# Altium project 555cv.prjPCB.PrjPcb (part 3 of 4)

## Sheet MCU_Signals.SchDoc
size A4; DocumentNumber: 5; SheetNumber: 5; SheetTotal: 8
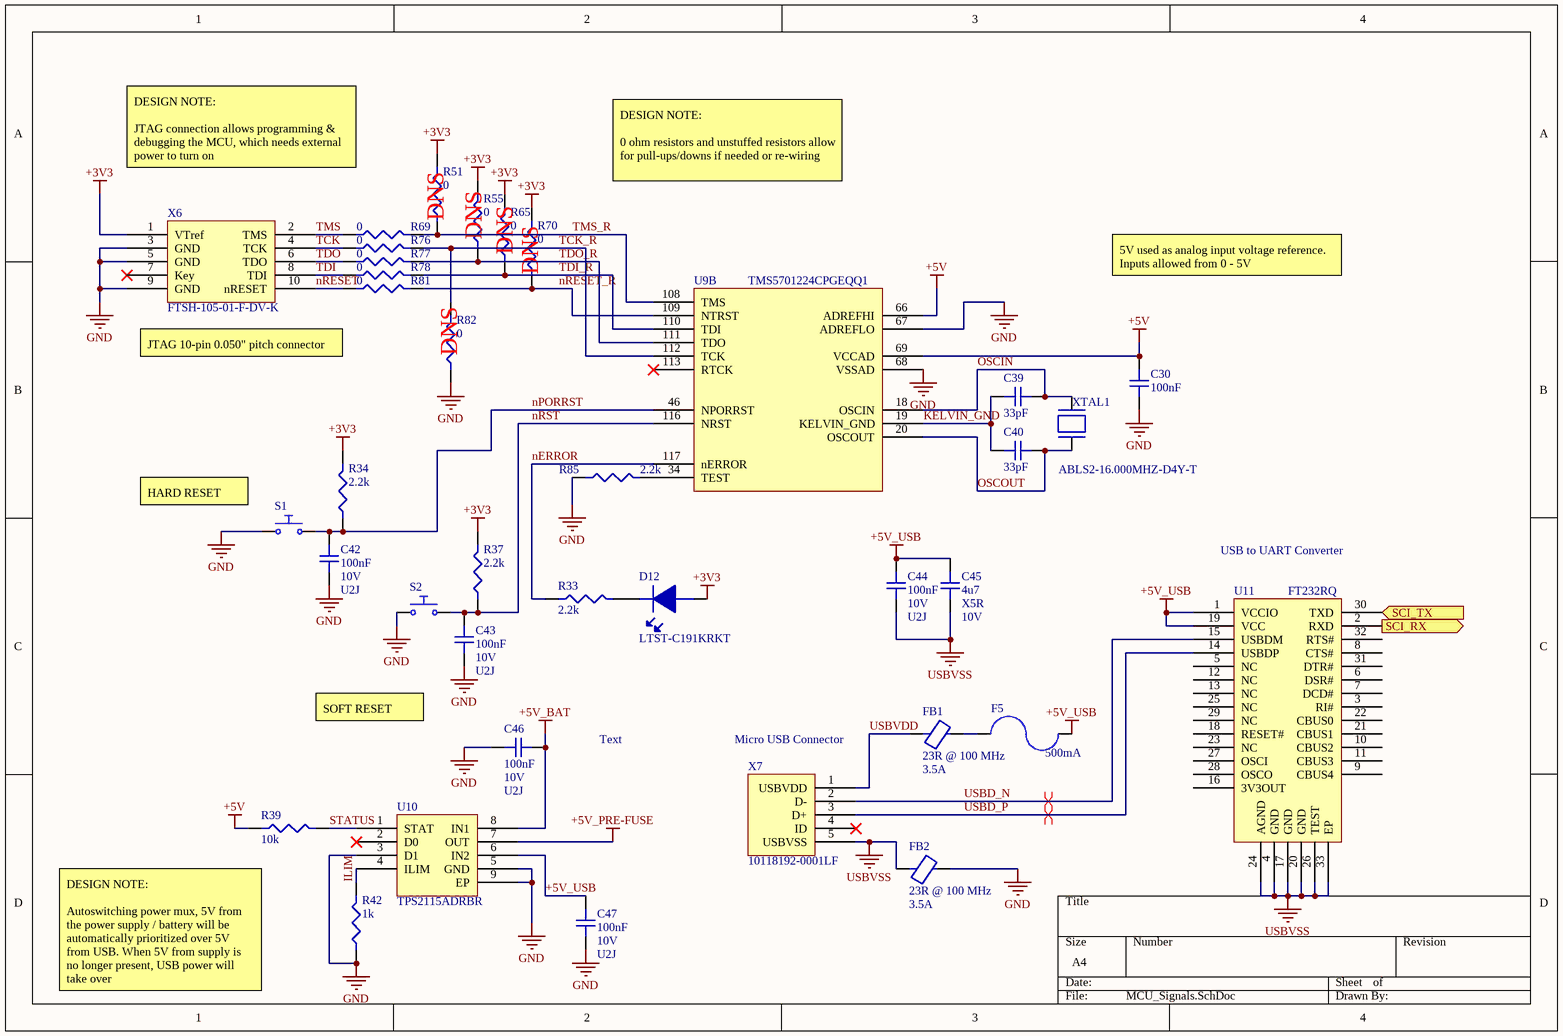
[diagram p4: MCU_Signals.SchDoc]

### Parts
C30  100nF  [C0805]
C39  33pF  [C0805]
C40  33pF  [C0805]
C42  100nF  Voltage Rating: 10V  Dielectric: U2J  [C0805]
C43  100nF  Voltage Rating: 10V  Dielectric: U2J  [C0805]
C44  100nF  Voltage Rating: 10V  Dielectric: U2J  [C0805]
C45  4u7  Dielectric: X5R  Voltage: 10V  [C0805]
C46  100nF  Voltage Rating: 10V  Dielectric: U2J  [C0805]
C47  100nF  Voltage Rating: 10V  Dielectric: U2J  [C0805]
D12  LTST-C191KRKT  [LED_0603]
F5  500mA  [FUSE_0603]
FB1  23R @ 100 MHz  Max Current Rating: 3.5A  [FB_1806]
FB2  23R @ 100 MHz  Max Current Rating: 3.5A  [FB_1806]
R33  2.2k  [R0805]
R34  2.2k  [R0805]
R37  2.2k  [R0805]
R39  10k  [R0805]
R42  1k  [R0805]
R51  0  [R0805]
R55  0  [R0805]
R65  0  [R0805]
R69  0  [R0805]
R70  0  [R0805]
R76  0  [R0805]
R77  0  [R0805]
R78  0  [R0805]
R81  0  [R0805]
R82  0  [R0805]
R85  2.2k  [R0805]
S1  PTS645SM43SMTR92LFS  [PUSH_BUTTON]  (value not drawn)
S2  PTS645SM43SMTR92LFS  [PUSH_BUTTON]  (value not drawn)
U9  TMS5701224CPGEQQ1  [LQFP-144]  (part B of 3)
U10  TPS2115ADRBR  [VSON-8]
U11  FT232RQ  [QFN-32]
X6  FTSH-105-01-F-DV-K  [JTAG_50mil_10pin]
X7  10118192-0001LF  [USB_MICRO]
XTAL1  ABLS2-16.000MHZ-D4Y-T  [XTAL]

### Ports
SCI_RX, SCI_TX

### Nets
+3V3: D12.1 R34.2 R37.2 R51.2 R55.2 R65.2 R70.2 X6.1(VTref)
+5V: C30.2 R39.1 U9.66(ADREFHI) U9.69(VCCAD)
+5V_BAT: C46.2 U10.8(IN1)
+5V_PRE-FUSE: U10.7(OUT)
+5V_USB: C44.2 C45.2 C47.1 F5.2 U10.6(IN2) U11.1(VCCIO) U11.19(VCC)
GND: C30.1 C42.1 C43.1 C46.1 C47.2 FB2.2 R42.1 R82.1 R85.1 S1.1 S2.1 U9.67(ADREFLO) U9.68(VSSAD) U10.3(D1) U10.5(GND) U10.9(EP) X6.3(GND) X6.5(GND) X6.9(GND)
USBVSS: C44.1 C45.1 FB2.1 U11.4(GND) U11.17(GND) U11.20(GND) U11.24(AGND) U11.26(TEST) U11.33(EP) X7.5(USBVSS)
ILIM: R42.2 U10.4(ILIM)
KELVIN_GND: C39.1 C40.1 U9.19(KELVIN_GND)
nERROR: R33.1 U9.117(nERROR)
nPORRST: C42.2 R34.1 S1.2 U9.46(NPORRST)
nRESET: R81.1 X6.10(nRESET)
nRESET_R: R70.1 R81.2 U9.109(NTRST)
nRST: C43.2 R37.1 S2.2 U9.116(NRST)
OSCIN: C39.2 U9.18(OSCIN) XTAL1.1
OSCOUT: C40.2 U9.20(OSCOUT) XTAL1.2
SCI_RX: U11.2(RXD) ; port SCI_RX
SCI_TX: U11.30(TXD) ; port SCI_TX
STATUS: R39.2 U10.1(STAT)
TCK: R76.1 X6.4(TCK)
TCK_R: R76.2 R82.2 U9.112(TCK)
TDI: R78.1 X6.8(TDI)
TDI_R: R65.1 R78.2 U9.110(TDI)
TDO: R77.1 X6.6(TDO)
TDO_R: R55.1 R77.2 U9.111(TDO)
TMS: R69.1 X6.2(TMS)
TMS_R: R51.1 R69.2 U9.108(TMS)
USBD_N: U11.15(USBDM) X7.2(D-)
USBD_P: U11.14(USBDP) X7.3(D+)
USBVDD: FB1.1 X7.1(USBVDD)
NetD12_2: D12.2 R33.2
NetF5_1: F5.1 FB1.2
NetR85_2: R85.2 U9.34(TEST)

Not connected (* = marked no-connect by the designer): U9 113(RTCK)*; U10 2(D0)*; U11 3(RI#) 5(NC) 6(DSR#) 7(DCD#) 8(CTS#) 9(CBUS4) 10(CBUS2) 11(CBUS3) 12(NC) 13(NC) 16(3V3OUT) 18(RESET#) 21(CBUS1) 22(CBUS0) 23(NC) 25(NC) 27(OSCI) 28(OSCO) 29(NC) 31(DTR#) 32(RTS#); X6 7(Key)*; X7 4(ID)*

### Layout directives
differential pair: USBD_N, USBD_P

### Notes on the sheet
- DESIGN NOTE:
  JTAG connection allows programming & debugging the MCU, which needs external power to turn on
- DESIGN NOTE:
  0 ohm resistors and unstuffed resistors allow for pull-ups/downs if needed or re-wiring
- (near R51) DNS
- (near R55) DNS
- (near R65) DNS
- (near R70) DNS
- 5V used as analog input voltage reference. Inputs allowed from 0 - 5V
- JTAG 10-pin 0.050" pitch connector
- (near R82) DNS
- (near S1) HARD RESET
- USB to UART Converter
- SOFT RESET
- Text
- (near X7) Micro USB Connector
- (near R39) DESIGN NOTE:
  Autoswitching power mux, 5V from the power supply / battery will be automatically prioritized over 5V from USB. When 5V from supply is no longer present, USB power will take over

### Library data of the parts
C30 = GRM21B7U1A104JA01L: CAP MLCC 100nF 10Volts U2J 5%; Manufacturer: Murata; Voltage Rating: 10V; Supplier 1: Digi-Key; Manufacturer Part Number: GRM21B7U1A104JA01L; Stock 1: 6000; Pricing 1: 1=0.46, 10=0.32, 100=0.192, 500=0.144, 1000=0.1216 (USD); Mount: Surface Mount; Case/Package: 0805; Case Code (Imperial): 0805; Case Code (Metric): 2012; Min Operating Temperature: -55°C; Max Operating Temperature: 125°C; Capacitance: 100nF; Voltage Rating (DC): 10V; Tolerance: 5%; Packaging: Tape and Reel; Package Quantity: 3000; Dielectric: U2J; Termination: SMD/SMT; Length: 2mm; Height: 1.25mm; Width: 0.049inch; Thickness: 0.053inch; Depth: 1.25mm; Radiation Hardening: No; ComponentLink1URL: https://datasheet.ciiva.com/5424/product-5424660.pdf; ComponentLink1Description: https://datasheet.ciiva.com/5424/product-5424660.pdf; ComponentLink2URL: https://datasheet.ciiva.com/17451/product-17451845.pdf; ComponentLink2Description: https://datasheet.ciiva.com/17451/product-17451845.pdf; ComponentLink3URL: https://datasheet.ciiva.com/11618/product-11618924.pdf; ComponentLink3Description: https://datasheet.ciiva.com/11618/product-11618924.pdf; Supplier Part Number 1: 490-11592-6-ND
C39 C40 = 885012007003: CAP MLCC 33pF 10V Ceramic Capacitor C0G, NP0 0805 (2012 Metric) 0.079" L x 0.049" W (2.00mm x 1.25mm); Manufacturer: Wurth Electronics; Tolerance: 5%; Supplier 1: Digi-Key; Manufacturer Part Number: 885012007003; Stock 1: 3090; Pricing 1: 1=0.1, 50=0.068, 100=0.062, 250=0.056, 500=0.05, 1000=0.045 (USD); Mount: Surface Mount; Case/Package: 0805; Case Code (Metric): 2012; Case Code (Imperial): 0805; Min Operating Temperature: -55°C; Max Operating Temperature: 125°C; Packaging: Tape and Reel; Capacitance: 33pF; Voltage Rating: 10V; Length: 0.079inch; Width: 0.049inch; Thickness: 0.028inch; Supplier Part Number 1: 732-7808-1-ND
C42-C44 C46 C47 = GRM21B7U1A104JA01L: CAP MLCC 100nF 10Volts U2J 5%; Manufacturer: Murata; Supplier 1: Digi-Key; Manufacturer Part Number: GRM21B7U1A104JA01L; Stock 1: 6000; Pricing 1: 1=0.46, 10=0.32, 100=0.192, 500=0.144, 1000=0.1216 (USD); Mount: Surface Mount; Case/Package: 0805; Case Code (Imperial): 0805; Case Code (Metric): 2012; Min Operating Temperature: -55°C; Max Operating Temperature: 125°C; Capacitance: 100nF; Voltage Rating (DC): 10V; Tolerance: 5%; Packaging: Tape and Reel; Package Quantity: 3000; Termination: SMD/SMT; Length: 2mm; Height: 1.25mm; Width: 0.049inch; Thickness: 0.053inch; Depth: 1.25mm; Radiation Hardening: No; ComponentLink1URL: https://datasheet.ciiva.com/5424/product-5424660.pdf; ComponentLink1Description: https://datasheet.ciiva.com/5424/product-5424660.pdf; ComponentLink2URL: https://datasheet.ciiva.com/17451/product-17451845.pdf; ComponentLink2Description: https://datasheet.ciiva.com/17451/product-17451845.pdf; ComponentLink3URL: https://datasheet.ciiva.com/11618/product-11618924.pdf; ComponentLink3Description: https://datasheet.ciiva.com/11618/product-11618924.pdf; Supplier Part Number 1: 490-11592-6-ND
C45 = GRM219R61A475KE34D: CAP MLCC 4.7µF ±10% 10V X5R Ceramic Capacitor -55°C ~ 85°C Surface Mount, MLCC 0805 (2012 Metric) 0.079" L x 0.049" W (2.00mm x 1.25mm); Manufacturer: Murata; Capacitance: 4.7uF; Supplier 1: Digi-Key; Manufacturer Part Number: GRM219R61A475KE34D; Stock 1: 251830; Pricing 1: 1=0.21, 10=0.152, 100=0.0716, 500=0.0502, 1000=0.0416 (USD); Mount: Surface Mount; Case/Package: 0805; Case Code (Metric): 2012; Case Code (Imperial): 0805; Min Operating Temperature: -55°C; Max Operating Temperature: 85°C; Packaging: Tape and Reel; Tolerance: 10%; Package Quantity: 4000; Voltage Rating: 10V; Voltage Rating (DC): 10V; Termination: SMD/SMT; Length: 2mm; Height: 0.85mm; Width: 0.049inch; Thickness: 0.037inch; Depth: 1.25mm; Lead Free: Lead Free; ComponentLink1URL: https://datasheet.ciiva.com/169/product-169527.pdf; ComponentLink1Description: https://datasheet.ciiva.com/169/product-169527.pdf; ComponentLink2URL: https://datasheet.ciiva.com/5414/product-5414984.pdf; ComponentLink2Description: https://datasheet.ciiva.com/5414/product-5414984.pdf; ComponentLink3URL: https://datasheet.ciiva.com/16467/product-16467258.pdf; ComponentLink3Description: https://datasheet.ciiva.com/16467/product-16467258.pdf; ComponentLink4URL: https://datasheet.ciiva.com/29542/product-29542667.pdf; ComponentLink4Description: https://datasheet.ciiva.com/29542/product-29542667.pdf; ComponentLink5URL: https://datasheet.ciiva.com/29542/product-29542668.pdf; ComponentLink5Description: https://datasheet.ciiva.com/29542/product-29542668.pdf; Supplier Part Number 1: 490-3339-6-ND
D12 = LTST-C191KRKT: LED RED CLEAR 0603 SMD; Manufacturer: Vishay Lite-On; Lens Colour: Colorless; Power Rating: 75mW; Luminous Intensity: 54mcd; Viewing Angle: 130°; Forward Voltage: 2V; Lens Style: Clear,Diffused,Colorless,Rectangular; Forward Current: 30mA; Dominant Wavelength: 631nm; Test Current: 20mA; Number of Elements: 1; Wavelength: 639nm; Reverse Voltage: 5V; Supplier 1: Digi-Key; Manufacturer Part Number: LTST-C191KRKT; Stock 1: 684119; Pricing 1: 1=0.29, 10=0.211, 25=0.1556, 100=0.1111, 250=0.0756, 500=0.0667, 1000=0.0522, 2500=0.0511 (USD); Mount: Surface Mount; Case/Package: 0603; Number of Pins: 2; Colour: Red; Case Code (Metric): 1608; Case Code (Imperial): 0603; Min Operating Temperature: -55°C; Max Operating Temperature: 85°C; Packaging: Tape and Reel; Package Quantity: 1; Illumination Colour: Red; Lens Transparency: Clear; Power Dissipation: 75mW; Number of LEDs: 1; Voltage: 2V; Length: 1.6mm; Height: 0.55mm; Width: 0.8mm; Depth: 0.8mm; Radiation Hardening: No; Lead Free: Lead Free; ComponentLink1URL: https://datasheet.ciiva.com/11773/0900766b80dc02b2-11773601.pdf; ComponentLink1Description: https://datasheet.ciiva.com/11773/0900766b80dc02b2-11773601.pdf; ComponentLink2URL: https://datasheet.ciiva.com/2109/s-110-ltst-c191krkt-2109970.pdf; ComponentLink2Description: https://datasheet.ciiva.com/2109/s-110-ltst-c191krkt-2109970.pdf; ComponentLink3URL: https://datasheet.ciiva.com/2109/s-110-ltst-c191krkt-2109971.pdf; ComponentLink3Description: https://datasheet.ciiva.com/2109/s-110-ltst-c191krkt-2109971.pdf; ComponentLink4URL: https://datasheet.ciiva.com/16212/ltst-c191krkt-16212419.pdf; ComponentLink4Description: https://datasheet.ciiva.com/16212/ltst-c191krkt-16212419.pdf; ComponentLink5URL: https://datasheet.ciiva.com/2109/s-110-ltst-c191krkt-2109972.pdf; ComponentLink5Description: https://datasheet.ciiva.com/2109/s-110-ltst-c191krkt-2109972.pdf; ComponentLink6URL: https://datasheet.ciiva.com/15117/getdatasheetpartid-141922-15117737.pdf; ComponentLink6Description: https://datasheet.ciiva.com/15117/getdatasheetpartid-141922-15117737.pdf; ComponentLink7URL: https://datasheet.ciiva.com/12400/lite-on-ltst-c191krkt-190135-12400910.pdf; ComponentLink7Description: https://datasheet.ciiva.com/12400/lite-on-ltst-c191krkt-190135-12400910.pdf; Supplier Part Number 1: 160-1447-1-ND
F5 = ERB-RE0R50V: FUSE_0.5A SMD 0603, 0.5A; Manufacturer: Panasonic ECG; Body Material: Alumina; Voltage Rating (DC): 32V; DC Cold Resistance: 330mR; Fuse Type: Board Mount (Cartridge Style Excluded); Approvals: UL; Supplier 1: Digi-Key; Manufacturer Part Number: ERB-RE0R50V; Stock 1: 15715; Pricing 1: 1=0.29, 5=0.284, 10=0.272, 50=0.2424, 100=0.2257, 250=0.2006, 500=0.1672, 1000=0.1588 (USD); Mount: Surface Mount; Case/Package: 0603; Number of Pins: 2; Case Code (Metric): 1608; Case Code (Imperial): 0603; Min Operating Temperature: -40°C; Max Operating Temperature: 125°C; Current Rating: 500mA; Packaging: Tape and Reel; Package Quantity: 5000; Max Voltage Rating (DC): 32V; Voltage Rating: 32V; Current: 500mA; Fuse Current: 500mA; Length: 1.6mm; Height: 0.54mm; Width: 0.8mm; Depth: 0.8mm; Radiation Hardening: No; REACH SVHC: No SVHC; ComponentLink1URL: https://datasheet.ciiva.com/299/afa0000ce6-299092.pdf; ComponentLink1Description: https://datasheet.ciiva.com/299/afa0000ce6-299092.pdf; ComponentLink2URL: https://datasheet.ciiva.com/299/afa0000ce6-299093.pdf; ComponentLink2Description: https://datasheet.ciiva.com/299/afa0000ce6-299093.pdf; ComponentLink3URL: https://datasheet.ciiva.com/299/afa0000ce6-299094.pdf; ComponentLink3Description: https://datasheet.ciiva.com/299/afa0000ce6-299094.pdf; ComponentLink4URL: https://datasheet.ciiva.com/25619/0900766b810c2f76-25619783.pdf; ComponentLink4Description: https://datasheet.ciiva.com/25619/0900766b810c2f76-25619783.pdf; ComponentLink5URL: https://datasheet.ciiva.com/11337/afa0000ce6-11337817.pdf; ComponentLink5Description: https://datasheet.ciiva.com/11337/afa0000ce6-11337817.pdf; ComponentLink6URL: https://datasheet.ciiva.com/5813/1328695-5813626.pdf; ComponentLink6Description: https://datasheet.ciiva.com/5813/1328695-5813626.pdf; ComponentLink7URL: https://datasheet.ciiva.com/46388/1328695-46388892.pdf; ComponentLink7Description: https://datasheet.ciiva.com/46388/1328695-46388892.pdf; ComponentLink8URL: https://datasheet.ciiva.com/30017/afa0000ce6-30017405.pdf; ComponentLink8Description: https://datasheet.ciiva.com/30017/afa0000ce6-30017405.pdf; ComponentLink9URL: https://datasheet.ciiva.com/46376/1328695-46376557.pdf; ComponentLink9Description: https://datasheet.ciiva.com/46376/1328695-46376557.pdf; Supplier Part Number 1: P15127CT-ND
FB1 FB2 = FBMJ4516HL230NTV: FERRITE BEAD Ind Chip Bead Multi-Layer 23Ohm 30% 100MHz Ferrite 3.5A 1806 T/R; Manufacturer: Taiyo Yuden; Resistance: 180623R; Number of Lines: 1; DC Resistance (DCR): 14mR; Supplier 1: Digi-Key; Manufacturer Part Number: FBMJ4516HL230NTV; Stock 1: 1819; Pricing 1: 1=0.26, 10=0.202, 25=0.1676, 50=0.1444, 100=0.1299, 250=0.1097, 500=0.0982, 1000=0.0837 (USD); Mount: Surface Mount; Case/Package: 1806; Core Material: Ferrite; Case Code (Metric): 4516; Case Code (Imperial): 1806; Min Operating Temperature: -40°C; Max Operating Temperature: 125°C; Tolerance: 30%; Impedance: 23R; Package Quantity: 2000; Packaging: Tape and Reel; Max DC Current: 3.5A; Termination: SMD/SMT; Test Frequency: 100MHz; Length: 0.177inch; Height: 1.1mm; Width: 1.6mm; Depth: 1.6mm; ComponentLink1URL: http://www.mouser.com/ds/2/396/chipbeads01_e-559265.pdf; ComponentLink1Description: http://www.mouser.com/ds/2/396/chipbeads01_e-559265.pdf; ComponentLink2URL: http://ds.yuden.co.jp/TYCOMPAS/ut/detail.do?productNo=FBMJ4516HL230NTV&fileName=FBMJ4516HL230NTV_SS&mode=specSheetDownload; ComponentLink2Description: http://ds.yuden.co.jp/TYCOMPAS/ut/detail.do?productNo=FBMJ4516HL230NTV&fileName=FBMJ4516HL230NTV_SS&mode=specSheetDownload; ComponentLink3URL: https://www.yuden.co.jp/ut/product/category/emisuppression/FBMJ4516HL230NTV_SS.pdf; ComponentLink3Description: https://www.yuden.co.jp/ut/product/category/emisuppression/FBMJ4516HL230NTV_SS.pdf; Supplier Part Number 1: 587-3857-1-ND
R33 R34 R37 R85 = RC0805JR-072K2L: RES SMD 2.2K OHM 5% 1/8W; Manufacturer: Yageo; Resistance: 2.2kR; Temperature Coefficient: 100ppm/°C; Power Rating: 125mW; Voltage Rating: 150V; Supplier 1: Digi-Key; Manufacturer Part Number: RC0805JR-072K2L; Stock 1: 810523; Pricing 1: 1=0.1, 10=0.019, 100=0.0076, 1000=0.0034, 2500=0.003 (USD); Case/Package: 0805; Contact Plating: Tin,Lead,Matte; Case Code (Imperial): 0805; Case Code (Metric): 2012; Min Operating Temperature: -55°C; Max Operating Temperature: 155°C; Tolerance: 5%; Packaging: Tape and Reel; Composition: Thick Film; Termination: SMD/SMT; Military Standard: Not; Length: 2mm; Depth: 1.25mm; Radiation Hardening: No; REACH SVHC: Unknown; Lead Free: Lead Free; ComponentLink1URL: https://datasheet.ciiva.com/12667/rc0805-12667397.pdf; ComponentLink1Description: https://datasheet.ciiva.com/12667/rc0805-12667397.pdf; ComponentLink2URL: https://datasheet.ciiva.com/15190/getdatasheetpartid-251869-15190044.pdf; ComponentLink2Description: https://datasheet.ciiva.com/15190/getdatasheetpartid-251869-15190044.pdf; ComponentLink3URL: https://datasheet.ciiva.com/7941/442941-7941935.pdf; ComponentLink3Description: https://datasheet.ciiva.com/7941/442941-7941935.pdf; Supplier Part Number 1: 311-2.2KARCT-ND
R39 = RC0805FR-071KL: RES SMD 10K OHM 1% 1/8W 0805; Manufacturer: Yageo Phycomp; Temperature Coefficient: 100ppm/°C; Resistance: 1KR; Voltage Rating (DC): 150V; Power Rating: 125mW; Supplier 1: Digi-Key; Manufacturer Part Number: RC0805FR-071KL; Stock 1: 5527973; Pricing 1: 1=0.1, 10=0.022, 100=0.0088, 1000=0.004, 2500=0.0034 (USD); Case/Package: 0805; Number of Pins: 2; Min Operating Temperature: -55°C; Max Operating Temperature: 155°C; Tolerance: 1%; Packaging: Cut Tape; Length: 2mm; Height: 0.5mm; Width: 1.25mm; Depth: 1.25mm; REACH SVHC: No SVHC; Lead Free: Lead Free
R42 = ERA-6AEB102V: RES SMD 1K OHM 0805 1K Ohm 0.1% 0.125W(1/8W) ±25ppm/C Molded SMD Automotive Punched T/R; Manufacturer: Panasonic ECG; Voltage Rating: 100V; Resistance: 1kR; Power Rating: 125mW; Temperature Coefficient: 25ppm/°C; Supplier 1: Digi-Key; Manufacturer Part Number: ERA-6AEB102V; Stock 1: 506583; Pricing 1: 1=0.36, 10=0.302, 100=0.1182, 1000=0.0495, 2500=0.0454 (USD); Mount: Surface Mount; Case/Package: 0805; Number of Pins: 2; Case Code (Metric): 2012; Case Code (Imperial): 0805; Contact Plating: Tin; Min Operating Temperature: -55°C; Max Operating Temperature: 155°C; Packaging: Tape and Reel; Tolerance: 0.1%; Package Quantity: 5000; Composition: Thin Film; Number of Terminations: 2; Military Standard: Not; Termination: SMD/SMT; Max Power Dissipation: 125mW; Length: 2mm; Height: 0.5mm; Width: 1.25mm; Depth: 1.25mm; Radiation Hardening: No; REACH SVHC: No SVHC; ComponentLink1URL: https://datasheet.ciiva.com/11811/0900766b80beefcc-11811155.pdf; ComponentLink1Description: https://datasheet.ciiva.com/11811/0900766b80beefcc-11811155.pdf; ComponentLink2URL: https://datasheet.ciiva.com/30057/54aoa0000ce26-30057591.pdf; ComponentLink2Description: https://datasheet.ciiva.com/30057/54aoa0000ce26-30057591.pdf; ComponentLink3URL: https://datasheet.ciiva.com/48536/era-eng-tds-48536727.pdf; ComponentLink3Description: https://datasheet.ciiva.com/48536/era-eng-tds-48536727.pdf; ComponentLink4URL: https://datasheet.ciiva.com/9198/aoa0000ce26-9198984.pdf; ComponentLink4Description: https://datasheet.ciiva.com/9198/aoa0000ce26-9198984.pdf; ComponentLink5URL: https://datasheet.ciiva.com/16782/70068849-16782808.pdf; ComponentLink5Description: https://datasheet.ciiva.com/16782/70068849-16782808.pdf; ComponentLink6URL: https://datasheet.ciiva.com/24025/aoa0000ce26-197354-24025849.pdf; ComponentLink6Description: https://datasheet.ciiva.com/24025/aoa0000ce26-197354-24025849.pdf; ComponentLink7URL: https://datasheet.ciiva.com/43455/485442-43455257.pdf; ComponentLink7Description: https://datasheet.ciiva.com/43455/485442-43455257.pdf; ComponentLink8URL: https://datasheet.ciiva.com/43457/485442-43457803.pdf; ComponentLink8Description: https://datasheet.ciiva.com/43457/485442-43457803.pdf; ComponentLink9URL: https://datasheet.ciiva.com/7942/485442-7942414.pdf; ComponentLink9Description: https://datasheet.ciiva.com/7942/485442-7942414.pdf; ComponentLink10URL: https://datasheet.ciiva.com/16201/aoa0000ce26-16201486.pdf; ComponentLink10Description: https://datasheet.ciiva.com/16201/aoa0000ce26-16201486.pdf; ComponentLink11URL: https://datasheet.ciiva.com/22783/485442-22783806.pdf; ComponentLink11Description: https://datasheet.ciiva.com/22783/485442-22783806.pdf; ComponentLink12URL: https://datasheet.ciiva.com/7942/485442-7942415.pdf; ComponentLink12Description: https://datasheet.ciiva.com/7942/485442-7942415.pdf; ComponentLink13URL: https://datasheet.ciiva.com/29184/453027-da-01-en-widerstand-0805-era-29184108.pdf; ComponentLink13Description: https://datasheet.ciiva.com/29184/453027-da-01-en-widerstand-0805-era-29184108.pdf; Supplier Part Number 1: P1.0KDACT-ND
R51 R55 R65 R69 R70 R76-R78 R81 R82 = RC0805JR-070RL: RES SMD 0 OHM 1/8W 0805; Manufacturer: Yageo; Resistance: 0mR; Tolerance: 5%; Voltage Rating: 150V; Power Rating: 125mW; Temperature Coefficient: 200ppm/°C; Supplier 1: Digi-Key; Manufacturer Part Number: RC0805JR-070RL; Stock 1: 5922085; Pricing 1: 1=0.1, 10=0.018, 25=0.0128, 50=0.0096, 100=0.0071, 250=0.0054, 500=0.0044, 1000=0.0032 (USD); Case/Package: 0805; Number of Pins: 2; Case Code (Imperial): 0805; Case Code (Metric): 2012; Contact Plating: Tin,Matte; Min Operating Temperature: -55°C; Max Operating Temperature: 155°C; Packaging: Tape and Reel; Voltage Rating (DC): 150V; Termination: SMD/SMT; Composition: Thick Film; Military Standard: Not; Length: 2mm; Height: 0.5mm; Width: 1.25mm; Depth: 1.25mm; Radiation Hardening: No; REACH SVHC: Unknown; Lead Free: Lead Free; ComponentLink1URL: https://datasheet.ciiva.com/7941/1738694-7941861.pdf; ComponentLink1Description: https://datasheet.ciiva.com/7941/1738694-7941861.pdf; ComponentLink2URL: https://datasheet.ciiva.com/7941/1738694-7941862.pdf; ComponentLink2Description: https://datasheet.ciiva.com/7941/1738694-7941862.pdf; ComponentLink3URL: https://datasheet.ciiva.com/11819/0900766b8106beab-11819430.pdf; ComponentLink3Description: https://datasheet.ciiva.com/11819/0900766b8106beab-11819430.pdf; ComponentLink4URL: https://datasheet.ciiva.com/7941/1738694-7941863.pdf; ComponentLink4Description: https://datasheet.ciiva.com/7941/1738694-7941863.pdf; ComponentLink5URL: https://datasheet.ciiva.com/15190/getdatasheetpartid-330685-15190028.pdf; ComponentLink5Description: https://datasheet.ciiva.com/15190/getdatasheetpartid-330685-15190028.pdf; Supplier Part Number 1: 311-0.0ARDKR-ND
S1 S2 = PTS645SM43SMTR92LFS: SWITCH TACTILE SPST-NO 0.05A 12V; Manufacturer: ITT C&K; Mechanical Life: 100000Cycles; Actuator Material: Nylon,Polyamide; Throw Configuration: SPST; Contact Resistance: 100mR; Operating Force: 160gf; Max Current Rating: 50mA; Illumination Type: Non-Illuminated,Illuminated; Switch Function: Off-Mom; Actuator Length: 0.85mm; Supplier 1: Digi-Key; Manufacturer Part Number: PTS645SM43SMTR92LFS; Stock 1: 188827; Pricing 1: 1=0.16, 10=0.157, 25=0.1516, 50=0.1462, 100=0.1381, 250=0.13, 500=0.1245 (USD); Mount: Surface Mount; Case/Package: SMD/SMT; Contact Plating: Silver; Contact Material: Silver; Colour: Black; Min Operating Temperature: -20°C; Max Operating Temperature: 60°C; Max Voltage Rating (DC): 12V; Packaging: Tape and Reel; Package Quantity: 1000; Current Rating: 50mA; Voltage Rating (DC): 12V; Termination: Gull Wing; Orientation: Straight; Length: 6mm; Depth: 9mm; REACH SVHC: No SVHC; Lead Free: Lead Free; ComponentLink1URL: https://datasheet.ciiva.com/29903/getdatasheetpartid-786341-29903846.pdf; ComponentLink1Description: https://datasheet.ciiva.com/29903/getdatasheetpartid-786341-29903846.pdf; ComponentLink2URL: https://datasheet.ciiva.com/14920/pts645-14920733.pdf; ComponentLink2Description: https://datasheet.ciiva.com/14920/pts645-14920733.pdf; ComponentLink3URL: https://datasheet.ciiva.com/14920/pts645-14920734.pdf; ComponentLink3Description: https://datasheet.ciiva.com/14920/pts645-14920734.pdf; ComponentLink4URL: https://datasheet.ciiva.com/14920/pts645-14920735.pdf; ComponentLink4Description: https://datasheet.ciiva.com/14920/pts645-14920735.pdf; ComponentLink5URL: https://datasheet.ciiva.com/29931/getdatasheetpartid-764615-29931183.pdf; ComponentLink5Description: https://datasheet.ciiva.com/29931/getdatasheetpartid-764615-29931183.pdf; Supplier Part Number 1: CKN9112CT-ND
U9 = TMS5701224CPGEQQ1: ARM CORTEX R4 LOCK STEP HERCULES MCU; Manufacturer: Texas Instruments; Frequency: 160MHz; Interface: I2C,SPI,CAN,UART,USART,LIN,SCI,EBI/EMI; Number of I/Os: 64; Oscillator Type: External; RAM Size: 192KB; Number of Timers/Counters: 2; Watchdog Timer: Yes; Memory Type: FLASH; Memory Size: 1.25MB; Density: 1310720B; Peripherals: POR,PWM,WDT,DMA; Supplier 1: Digi-Key; Manufacturer Part Number: TMS5701224CPGEQQ1; Stock 1: 113; Pricing 1: 1=22.12, 10=20.402, 100=17.4222, 500=15.8176 (USD); Case/Package: LQFP; Number of Pins: 144; Min Operating Temperature: -40°C; Max Operating Temperature: 125°C; Packaging: Tray; Number of Programmable I/O: 64; Max Frequency: 160MHz; Number of GPIO: 64; Core Architecture: ARM; Lead Free: Lead Free; ComponentLink1URL: http://www.ti.com/lit/pdf/spnu515; ComponentLink1Description: http://www.ti.com/lit/pdf/spnu515; ComponentLink2URL: http://www.ti.com/lit/gpn/tms570ls1224; ComponentLink2Description: http://www.ti.com/lit/gpn/tms570ls1224; ComponentLink3URL: http://www.ti.com/general/docs/lit/getliterature.tsp?genericPartNumber=TMS570LS1224&&fileType=pdf; ComponentLink3Description: http://www.ti.com/general/docs/lit/getliterature.tsp?genericPartNumber=TMS570LS1224&&fileType=pdf; Supplier Part Number 1: 296-47200-ND
U10 = TPS2115ADRBR: IC OR CTRLR SRC SELECT 8SON; Manufacturer: Texas Instruments; Operating Supply Voltage: 5.5V; Number of Inputs: 2; Number of Outputs: 1; Output Current: 1.25A; Max Power Dissipation: 2.5W; Min Input Voltage: 2.8V; On-State Resistance: 150mR; Turn-On Delay Time: 1ms; Turn-Off Delay Time: 5ms; Max Supply Current: 55uA; Supplier 1: Digi-Key; Manufacturer Part Number: TPS2115ADRBR; Stock 1: 13497; Pricing 1: 1=2.01, 10=1.801, 100=1.448, 500=1.1897, 1000=0.9857 (USD); Case/Package: TSSOP; Number of Pins: 8; Weight: 0.000847oz; Min Operating Temperature: -40°C; Max Operating Temperature: 85°C; Package Quantity: 3000; Packaging: Tape and Reel; Max Output Current: 1.25A; Max Input Voltage: 5.5V; Operating Supply Current: 55uA; Current - Output 2: 1.25A; Radiation Hardening: No; Lead Free: Lead Free; REACH SVHC: No SVHC; ComponentLink1URL: https://datasheet.ciiva.com/15109/getdatasheetpartid-221489-15109265.pdf; ComponentLink1Description: https://datasheet.ciiva.com/15109/getdatasheetpartid-221489-15109265.pdf; ComponentLink2URL: https://datasheet.ciiva.com/1960/tps2115a-1960792.pdf; ComponentLink2Description: https://datasheet.ciiva.com/1960/tps2115a-1960792.pdf; ComponentLink3URL: https://datasheet.ciiva.com/3232/tps2115a-3232536.pdf; ComponentLink3Description: https://datasheet.ciiva.com/3232/tps2115a-3232536.pdf; ComponentLink4URL: https://datasheet.ciiva.com/1960/tps2115a-1960793.pdf; ComponentLink4Description: https://datasheet.ciiva.com/1960/tps2115a-1960793.pdf; ComponentLink5URL: https://datasheet.ciiva.com/1960/tps2115a-1960794.pdf; ComponentLink5Description: https://datasheet.ciiva.com/1960/tps2115a-1960794.pdf; Supplier Part Number 1: 296-23394-1-ND
U11 = FT232RQ-REEL: IC USB FS SERIAL UART 32-QFN; Manufacturer: FTDI; Max Supply Voltage: 5.25V; Min Supply Voltage: 3.3V; Operating Supply Voltage: 5V; Number of Channels: 1; Data Rate: 12Mbps; Operating Supply Current: 15mA; Supplier 1: Digi-Key; Manufacturer Part Number: FT232RQ-REEL; Stock 1: 97831; Pricing 1: 1=4.5, 10=4.05, 100=3.65, 250=3.25, 500=2.85, 1000=2.65, 2500=2.35 (USD); Mount: Surface Mount; Case/Package: QFN EP; Number of Pins: 32; Weight: 0.006653oz; Min Operating Temperature: -40°C; Max Operating Temperature: 85°C; Packaging: Tape and Reel; Package Quantity: 6000; Interface: UART; Length: 5mm; Width: 5mm; Radiation Hardening: No; Lead Free: Lead Free; ComponentLink1URL: https://datasheet.ciiva.com/1505/1647396-1505445.pdf; ComponentLink1Description: https://datasheet.ciiva.com/1505/1647396-1505445.pdf; ComponentLink2URL: https://datasheet.ciiva.com/1787/ds-ft232r-1787041.pdf; ComponentLink2Description: https://datasheet.ciiva.com/1787/ds-ft232r-1787041.pdf; ComponentLink3URL: https://datasheet.ciiva.com/1787/ds-ft232r-1787042.pdf; ComponentLink3Description: https://datasheet.ciiva.com/1787/ds-ft232r-1787042.pdf; ComponentLink4URL: https://datasheet.ciiva.com/16438/ds-ft232r-16438555.pdf; ComponentLink4Description: https://datasheet.ciiva.com/16438/ds-ft232r-16438555.pdf; ComponentLink5URL: https://datasheet.ciiva.com/15150/getdatasheetpartid-644721-15150509.pdf; ComponentLink5Description: https://datasheet.ciiva.com/15150/getdatasheetpartid-644721-15150509.pdf; ComponentLink6URL: https://datasheet.ciiva.com/4787/ds-ft232r-4787663.pdf; ComponentLink6Description: https://datasheet.ciiva.com/4787/ds-ft232r-4787663.pdf; ComponentLink7URL: https://datasheet.ciiva.com/26841/ft232rq-reel-26841082.pdf; ComponentLink7Description: https://datasheet.ciiva.com/26841/ft232rq-reel-26841082.pdf; Supplier Part Number 1: 768-1008-1-ND
X6 = FTSH-105-01-F-DV-K: CONN_JTAG_10pin .050 Connector Dual Header 10 Position Surface Mount; Manufacturer: Samtec; Max Current Rating: 1.75A; Number of Positions: 10; Connector Type: Male Pin; Pitch: 1.27mm; Row Spacing: 0.05inch; Supplier 1: Digi-Key; Manufacturer Part Number: FTSH-105-01-F-DV-K; Stock 1: 18199; Pricing 1: 1=2.9, 10=2.784, 100=2.32, 500=1.972, 1000=1.682, 5000=1.508 (USD); Mount: Surface Mount; Contact Material: Bronze,Copper; Contact Plating: Nickel,Gold; Colour: Black; Housing Colour: Black; Housing Material: Polymer; Min Operating Temperature: -55°C; Max Operating Temperature: 125°C; Number of Rows: 2; Packaging: Rail/Tube; Package Quantity: 1; Termination: Solder; Number of Contacts: 10; Orientation: Straight; Length: 15.2mm; Height: 3.3mm; Contact Mating Length: 0.12inch; Depth: 3.43mm; Radiation Hardening: No; Lead Free: Lead Free; ComponentLink1URL: https://datasheet.ciiva.com/19461/2046846-19461026.pdf; ComponentLink1Description: https://datasheet.ciiva.com/19461/2046846-19461026.pdf; ComponentLink2URL: https://datasheet.ciiva.com/738/ftsh-1xx-xx-xxx-dv-xxx-mkt-738998.pdf; ComponentLink2Description: https://datasheet.ciiva.com/738/ftsh-1xx-xx-xxx-dv-xxx-mkt-738998.pdf; ComponentLink3URL: https://datasheet.ciiva.com/10245/ftsh-mt-10245273.pdf; ComponentLink3Description: https://datasheet.ciiva.com/10245/ftsh-mt-10245273.pdf; ComponentLink4URL: https://datasheet.ciiva.com/16657/ftsh-mt-16657371.pdf; ComponentLink4Description: https://datasheet.ciiva.com/16657/ftsh-mt-16657371.pdf; ComponentLink5URL: https://datasheet.ciiva.com/15195/getdatasheetpartid-133463-15195260.pdf; ComponentLink5Description: https://datasheet.ciiva.com/15195/getdatasheetpartid-133463-15195260.pdf; Supplier Part Number 1: SAM8796-ND
X7 = 10118192-0001LF: CONN_USB - micro B USB 2.0 Receptacle Connector 5 Position Surface Mount, Right Angle, Horizontal; Manufacturer: Amphenol FCI; Current Rating: 1.8A; Connector Type: USB,Receptacle; Number of Contacts: 5; Insulation Resistance: 1GR; Number of Ports: 1; Max Voltage Rating (AC): 100V; USB Standard: USB 2.0; Pitch: 0.65mm; Supplier 1: Digi-Key; Manufacturer Part Number: 10118192-0001LF; Stock 1: 197826; Pricing 1: 1=0.46, 10=0.437, 25=0.3744, 50=0.318, 100=0.3056, 250=0.2744, 500=0.262 (USD); Mount: Surface Mount,Horizontal; Contact Material: Copper Alloy; Contact Plating: Nickel,Gold; Number of Terminals: 5; Housing Material: Polymer; Colour: Black; Min Operating Temperature: -55°C; Max Operating Temperature: 85°C; Packaging: Tape and Reel; Package Quantity: 1400; Gender: Receptacle; Termination: Solder; Voltage Rating: 100V; Orientation: Right Angle; Length: 7.86mm; Depth: 5.57mm; Radiation Hardening: No; REACH SVHC: No SVHC; Lead Free: Lead Free; Flammability Rating: UL94 V-0; ComponentLink1URL: https://datasheet.ciiva.com/26853/getdatasheetpartid-418041-26853891.pdf; ComponentLink1Description: https://datasheet.ciiva.com/26853/getdatasheetpartid-418041-26853891.pdf; ComponentLink2URL: https://datasheet.ciiva.com/851/10118192-851112.pdf; ComponentLink2Description: https://datasheet.ciiva.com/851/10118192-851112.pdf; ComponentLink3URL: https://datasheet.ciiva.com/4598/10118192ac-197249-4598796.pdf; ComponentLink3Description: https://datasheet.ciiva.com/4598/10118192ac-197249-4598796.pdf; Supplier Part Number 1: 609-4613-1-ND
XTAL1 = ABLS2-16.000MHZ-D4Y-T: XTAL 16MHz ±30ppm Crystal 18pF 40 Ohm -40°C ~ 85°C  Surface Mount HC49/US; Manufacturer: Abracon; ESR (Equivalent Series Resistance): 40R; Supplier 1: Digi-Key; Manufacturer Part Number: ABLS2-16.000MHZ-D4Y-T; Stock 1: 14083; Pricing 1: 1=0.46, 10=0.385, 50=0.3466, 100=0.308, 500=0.2926 (USD); Mount: Surface Mount; Min Operating Temperature: -40°C; Max Operating Temperature: 85°C; Package Quantity: 1000; Frequency: 16MHz; Frequency Tolerance: 30ppm; Load Capacitance: 18pF; Packaging: Tape and Reel; Tolerance: 30ppm; Frequency Stability: 30ppm; Termination: SMD/SMT; Series Resistance: 40R; Length: 11.05mm; Height: 0.13inch; Width: 0.185inch; Depth: 4.8mm; REACH SVHC: Unknown; Lead Free: Lead Free; ComponentLink1URL: https://datasheet.ciiva.com/854/abls2-854400.pdf; ComponentLink1Description: https://datasheet.ciiva.com/854/abls2-854400.pdf; ComponentLink2URL: https://datasheet.ciiva.com/854/abls2-854401.pdf; ComponentLink2Description: https://datasheet.ciiva.com/854/abls2-854401.pdf; ComponentLink3URL: https://datasheet.ciiva.com/15116/getdatasheetpartid-719900-15116780.pdf; ComponentLink3Description: https://datasheet.ciiva.com/15116/getdatasheetpartid-719900-15116780.pdf; ComponentLink4URL: https://datasheet.ciiva.com/854/abls2-854399.pdf; ComponentLink4Description: https://datasheet.ciiva.com/854/abls2-854399.pdf; Supplier Part Number 1: 535-9875-1-ND

## Sheet CAN.SchDoc
size A4; DocumentNumber: 6; SheetNumber: 6; SheetTotal: 8
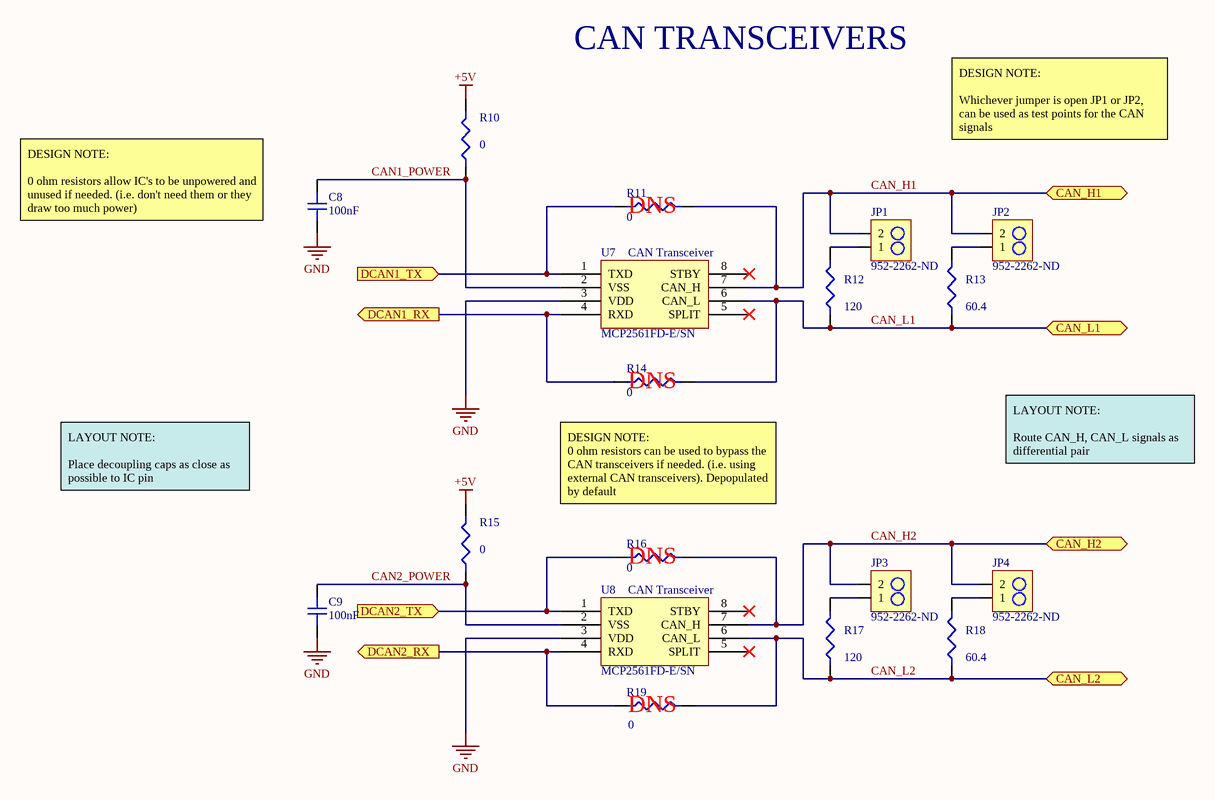
[diagram p5: CAN.SchDoc]

### Parts
C8  100nF  [C0805]
C9  100nF  [C0805]
JP1  952-2262-ND  [2PIN_HEADER]
JP2  952-2262-ND  [2PIN_HEADER]
JP3  952-2262-ND  [2PIN_HEADER]
JP4  952-2262-ND  [2PIN_HEADER]
R10  0  [R0805]
R11  0  [R0805]
R12  120  [R0805]
R13  60.4  [R0805]
R14  0  [R0805]
R15  0  [R0805]
R16  0  [R0805]
R17  120  [R0805]
R18  60.4  [R0805]
R19  0  [R0805]
U7  MCP2561FD-E/SN  [8-SOIC_MCP2561]
U8  MCP2561FD-E/SN  [8-SOIC_MCP2561]

### Ports
CAN_H1, CAN_H2, CAN_L1, CAN_L2, DCAN1_RX, DCAN1_TX, DCAN2_RX, DCAN2_TX

### Nets
+5V: R10.2 R15.2
GND: C8.1 C9.1 U7.3(VDD) U8.3(VDD)
CAN1_POWER: C8.2 R10.1 U7.2(VSS)
CAN2_POWER: C9.2 R15.1 U8.2(VSS)
CAN_H1: JP1.2 JP2.2 R11.2 U7.7(CAN_H) ; port CAN_H1
CAN_H2: JP3.2 JP4.2 R16.2 U8.7(CAN_H) ; port CAN_H2
CAN_L1: R12.1 R13.1 R14.2 U7.6(CAN_L) ; port CAN_L1
CAN_L2: R17.1 R18.1 R19.2 U8.6(CAN_L) ; port CAN_L2
DCAN1_RX: R14.1 U7.4(RXD) ; port DCAN1_RX
DCAN1_TX: R11.1 U7.1(TXD) ; port DCAN1_TX
DCAN2_RX: R19.1 U8.4(RXD) ; port DCAN2_RX
DCAN2_TX: R16.1 U8.1(TXD) ; port DCAN2_TX
NetJP1_1: JP1.1 R12.2
NetJP2_1: JP2.1 R13.2
NetJP3_1: JP3.1 R17.2
NetJP4_1: JP4.1 R18.2

Not connected (* = marked no-connect by the designer): U7 5(SPLIT)* 8(STBY)*; U8 5(SPLIT)* 8(STBY)*

### Notes on the sheet
- CAN TRANSCEIVERS
- DESIGN NOTE:
  Whichever jumper is open JP1 or JP2, can be used as test points for the CAN signals
- DESIGN NOTE:
  0 ohm resistors allow IC's to be unpowered and unused if needed. (i.e. don't need them or they draw too much power)
- (near R11) DNS
- (near U7) CAN Transceiver
- (near R14) DNS
- LAYOUT NOTE:
  Place decoupling caps as close as possible to IC pin
- LAYOUT NOTE:
  Route CAN_H, CAN_L signals as differential pair
- DESIGN NOTE:
  0 ohm resistors can be used to bypass the CAN transceivers if needed. (i.e. using external CAN transceivers). Depopulated by default
- (near U8) CAN Transceiver
- (near R16) DNS
- (near R19) DNS

### Library data of the parts
C8 C9 = GRM21B7U1A104JA01L: as C30 on sheet MCU_Signals; Supplier 1: Digi-Key; Manufacturer Part Number: GRM21B7U1A104JA01L; Stock 1: 6000; Pricing 1: 1=0.46, 10=0.32, 100=0.192, 500=0.144, 1000=0.1216 (USD); Mount: Surface Mount; Case/Package: 0805; Case Code (Imperial): 0805; Case Code (Metric): 2012; Min Operating Temperature: -55°C; Max Operating Temperature: 125°C; Capacitance: 100nF; Voltage Rating (DC): 10V; Tolerance: 5%; Packaging: Tape and Reel; Package Quantity: 3000; Dielectric: U2J; Termination: SMD/SMT; Length: 2mm; Height: 1.25mm; Width: 0.049inch; Thickness: 0.053inch; Depth: 1.25mm; Radiation Hardening: No; ComponentLink1URL: https://datasheet.ciiva.com/5424/product-5424660.pdf; ComponentLink1Description: https://datasheet.ciiva.com/5424/product-5424660.pdf; ComponentLink2URL: https://datasheet.ciiva.com/17451/product-17451845.pdf; ComponentLink2Description: https://datasheet.ciiva.com/17451/product-17451845.pdf; ComponentLink3URL: https://datasheet.ciiva.com/11618/product-11618924.pdf; ComponentLink3Description: https://datasheet.ciiva.com/11618/product-11618924.pdf; Supplier Part Number 1: 490-11592-6-ND
JP1-JP4 = M20-9990246: CONN_HeaderPins2pos Headers & Wire Housings 02 SIL VERTICAL PIN HEADER TIN; Manufacturer: Harwin; Contact Resistance: 30mR; Max Current Rating: 3A; Number of Positions: 2; Gender: Male; Connector Type: Male Pin; Insulation Resistance: 10GR; Voltage Rating (AC): 750V; Pitch: 2.54mm; Supplier 1: Digi-Key; Manufacturer Part Number: M20-9990246; Stock 1: 53577; Pricing 1: 1=0.11, 10=0.099, 100=0.0609, 500=0.0504, 1000=0.0441, 5000=0.0378, 10000=0.0368 (USD); Case/Package: SIL; Colour: Black; Housing Colour: Black; Housing Material: Nylon; Contact Plating: Tin; Contact Material: Bronze,Brass; Min Operating Temperature: -40°C; Max Operating Temperature: 105°C; Package Quantity: 1000; Packaging: Bulk; Termination: Solder; Number of Rows: 1; Number of Contacts: 2; Orientation: Straight; Current Rating: 3A; Length: 5.08mm; Depth: 2.54mm; Contact Mating Length: 0.24inch; Radiation Hardening: No; REACH SVHC: No SVHC; ComponentLink1URL: https://datasheet.ciiva.com/8046/315376-8046930.pdf; ComponentLink1Description: https://datasheet.ciiva.com/8046/315376-8046930.pdf; ComponentLink2URL: https://datasheet.ciiva.com/6833/m20-999-6833368.pdf; ComponentLink2Description: https://datasheet.ciiva.com/6833/m20-999-6833368.pdf; ComponentLink3URL: https://datasheet.ciiva.com/11745/0900766b81034e61-11745755.pdf; ComponentLink3Description: https://datasheet.ciiva.com/11745/0900766b81034e61-11745755.pdf; ComponentLink4URL: https://datasheet.ciiva.com/22660/1830818-22660571.pdf; ComponentLink4Description: https://datasheet.ciiva.com/22660/1830818-22660571.pdf; ComponentLink5URL: https://datasheet.ciiva.com/26852/getdatasheetpartid-384170-26852203.pdf; ComponentLink5Description: https://datasheet.ciiva.com/26852/getdatasheetpartid-384170-26852203.pdf; Supplier Part Number 1: 952-2262-ND
R10 R11 R14-R16 R19 = RC0805JR-070RL: as R51 on sheet MCU_Signals; Supplier 1: Digi-Key; Manufacturer Part Number: RC0805JR-070RL; Stock 1: 5922085; Pricing 1: 1=0.1, 10=0.018, 25=0.0128, 50=0.0096, 100=0.0071, 250=0.0054, 500=0.0044, 1000=0.0032 (USD); Case/Package: 0805; Number of Pins: 2; Case Code (Imperial): 0805; Case Code (Metric): 2012; Contact Plating: Tin,Matte; Min Operating Temperature: -55°C; Max Operating Temperature: 155°C; Packaging: Tape and Reel; Voltage Rating (DC): 150V; Termination: SMD/SMT; Composition: Thick Film; Military Standard: Not; Length: 2mm; Height: 0.5mm; Width: 1.25mm; Depth: 1.25mm; Radiation Hardening: No; REACH SVHC: Unknown; Lead Free: Lead Free; ComponentLink1URL: https://datasheet.ciiva.com/7941/1738694-7941861.pdf; ComponentLink1Description: https://datasheet.ciiva.com/7941/1738694-7941861.pdf; ComponentLink2URL: https://datasheet.ciiva.com/7941/1738694-7941862.pdf; ComponentLink2Description: https://datasheet.ciiva.com/7941/1738694-7941862.pdf; ComponentLink3URL: https://datasheet.ciiva.com/11819/0900766b8106beab-11819430.pdf; ComponentLink3Description: https://datasheet.ciiva.com/11819/0900766b8106beab-11819430.pdf; ComponentLink4URL: https://datasheet.ciiva.com/7941/1738694-7941863.pdf; ComponentLink4Description: https://datasheet.ciiva.com/7941/1738694-7941863.pdf; ComponentLink5URL: https://datasheet.ciiva.com/15190/getdatasheetpartid-330685-15190028.pdf; ComponentLink5Description: https://datasheet.ciiva.com/15190/getdatasheetpartid-330685-15190028.pdf; Supplier Part Number 1: 311-0.0ARDKR-ND
R12 R17 = RC0805FR-07120RL: RES SMD 120 OHM 1% 1/8W 0805; Manufacturer: Yageo; Resistance: 120R; Power Rating: 125mW; Voltage Rating: 150V; Temperature Coefficient: 100ppm/°C; Supplier 1: Digi-Key; Manufacturer Part Number: RC0805FR-07120RL; Stock 1: 632664; Pricing 1: 1=0.1, 10=0.022, 100=0.0088, 1000=0.004, 2500=0.0034 (USD); Case/Package: 0805; Case Code (Metric): 2012; Case Code (Imperial): 0805; Min Operating Temperature: -55°C; Max Operating Temperature: 155°C; Tolerance: 1%; Package Quantity: 1; Packaging: Tape and Reel; Composition: Thick Film; Number of Terminations: 2; Termination: SMD/SMT; Military Standard: Not; Max Power Dissipation: 125mW; Length: 2mm; Height: 0.5mm; Width: 0.049inch; Depth: 1.25mm; REACH SVHC: Unknown; Lead Free: Lead Free; ComponentLink1URL: https://datasheet.ciiva.com/2491/pyu-r-int-thick-7-2491585.pdf; ComponentLink1Description: https://datasheet.ciiva.com/2491/pyu-r-int-thick-7-2491585.pdf; ComponentLink2URL: https://datasheet.ciiva.com/2491/pyu-r-int-thick-7-2491586.pdf; ComponentLink2Description: https://datasheet.ciiva.com/2491/pyu-r-int-thick-7-2491586.pdf; ComponentLink3URL: https://datasheet.ciiva.com/2491/pyu-r-int-thick-7-2491587.pdf; ComponentLink3Description: https://datasheet.ciiva.com/2491/pyu-r-int-thick-7-2491587.pdf; ComponentLink4URL: https://datasheet.ciiva.com/12558/rc0805-257173-12558661.pdf; ComponentLink4Description: https://datasheet.ciiva.com/12558/rc0805-257173-12558661.pdf; ComponentLink5URL: https://datasheet.ciiva.com/11819/0900766b8106beab-11819786.pdf; ComponentLink5Description: https://datasheet.ciiva.com/11819/0900766b8106beab-11819786.pdf; ComponentLink6URL: https://datasheet.ciiva.com/7941/444164-7941691.pdf; ComponentLink6Description: https://datasheet.ciiva.com/7941/444164-7941691.pdf; ComponentLink7URL: https://datasheet.ciiva.com/7941/444164-7941692.pdf; ComponentLink7Description: https://datasheet.ciiva.com/7941/444164-7941692.pdf; ComponentLink8URL: https://datasheet.ciiva.com/16964/rc0805-16964606.pdf; ComponentLink8Description: https://datasheet.ciiva.com/16964/rc0805-16964606.pdf; Supplier Part Number 1: 311-120CRCT-ND
R13 R18 = RC0805FR-0760R4L: RES SMD 60.4 OHM 1% 1/8W 0805; Manufacturer: Yageo; Resistance: 60.4R; Power Rating: 125mW; Temperature Coefficient: 100ppm/°C; Voltage Rating (DC): 150V; Supplier 1: Digi-Key; Manufacturer Part Number: RC0805FR-0760R4L; Stock 1: 189238; Pricing 1: 1=0.1, 10=0.022, 100=0.0088, 1000=0.004, 2500=0.0034 (USD); Case/Package: 0805; Case Code (Metric): 2012; Case Code (Imperial): 0805; Contact Plating: Tin,Lead,Matte; Min Operating Temperature: -55°C; Max Operating Temperature: 155°C; Package Quantity: 1; Tolerance: 1%; Packaging: Tape and Reel; Composition: Thick Film; Military Standard: Not; Voltage Rating: 150V; Number of Terminations: 2; Termination: SMD/SMT; Max Power Dissipation: 125mW; Length: 0.079inch; Height: 0.024inch; Width: 0.049inch; Depth: 1.25mm; Radiation Hardening: No; Lead Free: Lead Free; ComponentLink1URL: https://datasheet.ciiva.com/2457/pyu-r-int-thick-7-2457216.pdf; ComponentLink1Description: https://datasheet.ciiva.com/2457/pyu-r-int-thick-7-2457216.pdf; ComponentLink2URL: https://datasheet.ciiva.com/2457/pyu-r-int-thick-7-2457217.pdf; ComponentLink2Description: https://datasheet.ciiva.com/2457/pyu-r-int-thick-7-2457217.pdf; ComponentLink3URL: https://datasheet.ciiva.com/2457/pyu-r-int-thick-7-2457215.pdf; ComponentLink3Description: https://datasheet.ciiva.com/2457/pyu-r-int-thick-7-2457215.pdf; Supplier Part Number 1: 311-60.4CRDKR-ND
U7 U8 = MCP2561FD-E/SN: IC CAN Bus, Transceiver, CAN, 1, 1, 4.5 V, 5.5 V, SOIC; Manufacturer: Microchip; Number of Receivers: 1; Data Rate: 8Mbps; Min Supply Voltage: 4.5V; Max Supply Voltage: 5.5V; Max Supply Current: 70mA; Receiver Hysteresis: 200mV; Supplier 1: Digi-Key; Manufacturer Part Number: MCP2561FD-E/SN; Stock 1: 1072; Pricing 1: 1=0.97, 25=0.8084, 100=0.735 (USD); Case/Package: SOIC; Number of Pins: 8; Weight: 0.019048oz; Min Operating Temperature: -40°C; Max Operating Temperature: 125°C; Packaging: Rail/Tube; Number of Transceivers: 1; Logic Function: Transceiver; Interface: CAN; Number of Drivers: 1; Number of Transmit Buffers: 1; Number of Receive Buffers: 1; Operating Supply Current: 70mA; Package Quantity: 100; Length: 4.9mm; Height: 1.5mm; Width: 3.9mm; REACH SVHC: No SVHC; Lead Free: Lead Free; ComponentLink1URL: https://datasheet.ciiva.com/48512/mcp2561fd-eng-tds-48512069.pdf; ComponentLink1Description: https://datasheet.ciiva.com/48512/mcp2561fd-eng-tds-48512069.pdf; ComponentLink2URL: https://datasheet.ciiva.com/46406/1821190-46406024.pdf; ComponentLink2Description: https://datasheet.ciiva.com/46406/1821190-46406024.pdf; ComponentLink3URL: https://datasheet.ciiva.com/46406/1821190-46406056.pdf; ComponentLink3Description: https://datasheet.ciiva.com/46406/1821190-46406056.pdf; ComponentLink4URL: https://datasheet.ciiva.com/48473/20005284a-48473177.pdf; ComponentLink4Description: https://datasheet.ciiva.com/48473/20005284a-48473177.pdf